# Altium schematic sheet Power_Path.SchDoc
size 297 x 209 mm; SheetNumber: 4; SheetTotal: 4
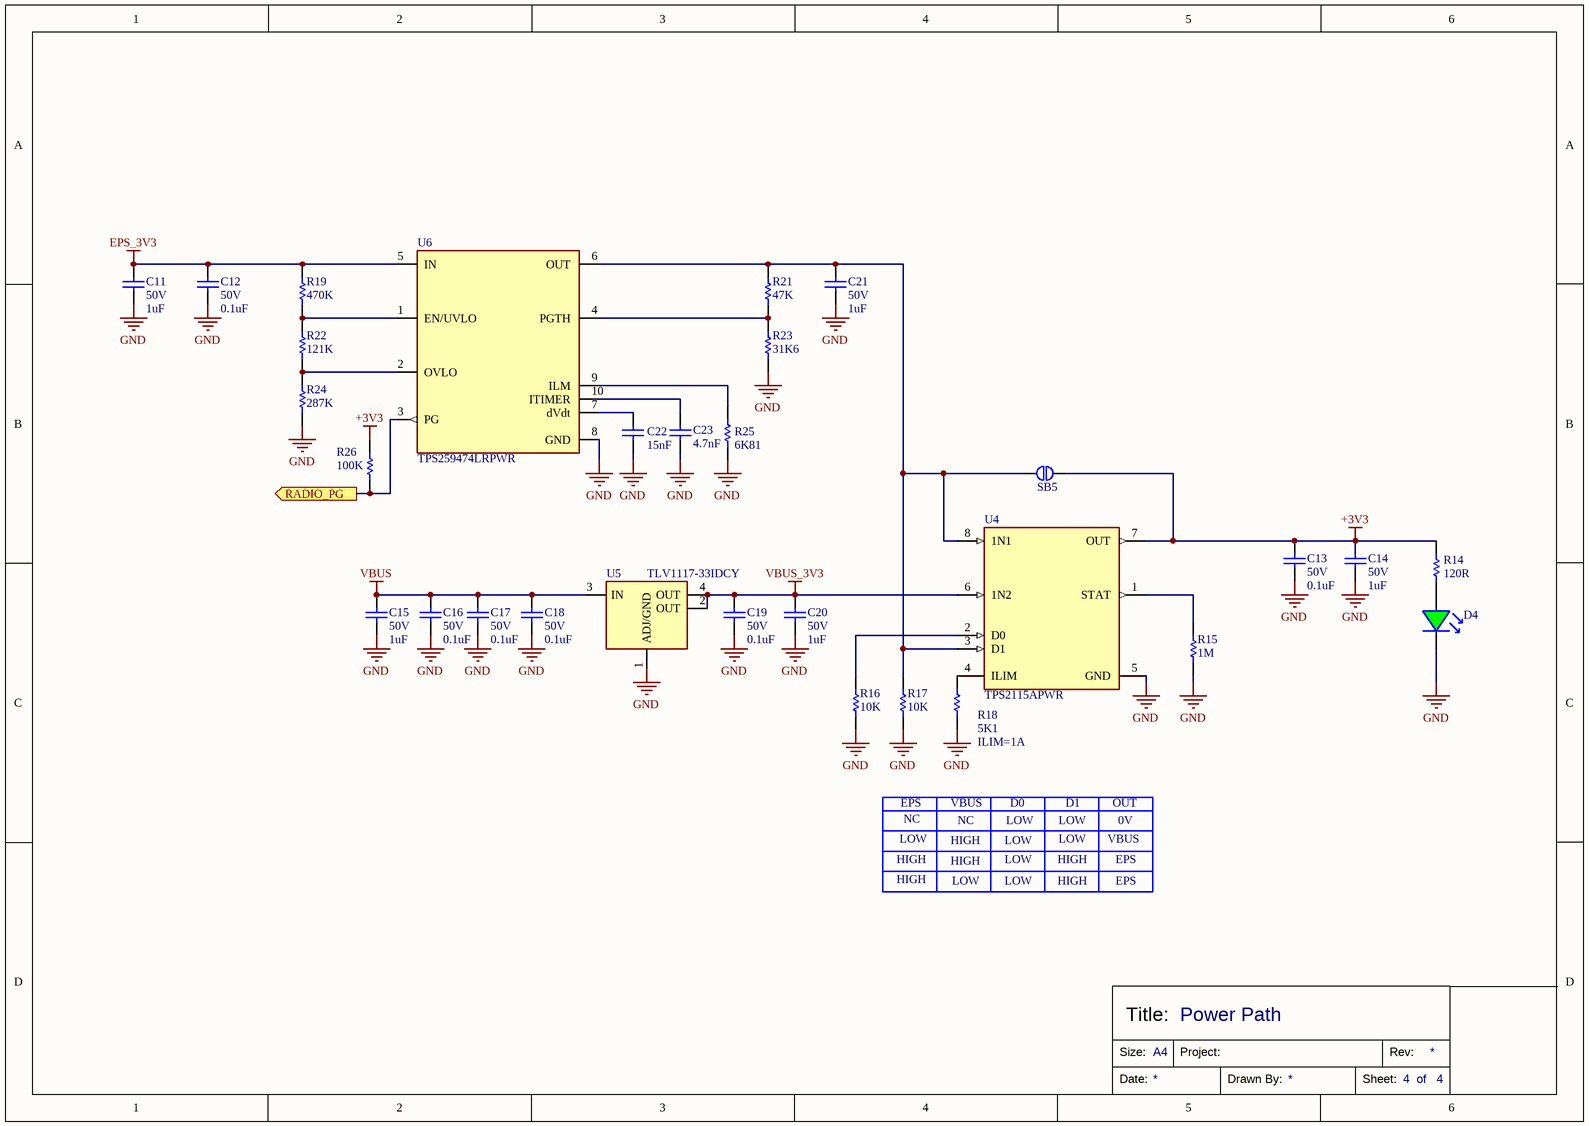
[diagram p0: Power_Path.SchDoc]

## Parts
C11  Voltage Rating: 50V  Capacitance: 1uF  [CAPC0805X060]  (hidden comment: CL21B105KBFNNNE_1)
C12  Voltage Rating: 50V  Capacitance: 0.1uF  [CAPC0402X020]  (hidden comment: CL05B104KB5NNNC)
C13  Voltage Rating: 50V  Capacitance: 0.1uF  [CAPC0402X020]  (hidden comment: CL05B104KB5NNNC)
C14  Voltage Rating: 50V  Capacitance: 1uF  [CAPC0805X060]  (hidden comment: CL21B105KBFNNNE_1)
C15  Voltage Rating: 50V  Capacitance: 1uF  [CAPC0805X060]  (hidden comment: CL21B105KBFNNNE_1)
C16  Voltage Rating: 50V  Capacitance: 0.1uF  [CAPC0402X020]  (hidden comment: CL05B104KB5NNNC)
C17  Voltage Rating: 50V  Capacitance: 0.1uF  [CAPC0402X020]  (hidden comment: CL05B104KB5NNNC)
C18  Voltage Rating: 50V  Capacitance: 0.1uF  [CAPC0402X020]  (hidden comment: CL05B104KB5NNNC)
C19  Voltage Rating: 50V  Capacitance: 0.1uF  [CAPC0402X020]  (hidden comment: CL05B104KB5NNNC)
C20  Voltage Rating: 50V  Capacitance: 1uF  [CAPC0805X060]  (hidden comment: CL21B105KBFNNNE_1)
C21  Voltage Rating: 50V  Capacitance: 1uF  [CAPC0805X060]  (hidden comment: CL21B105KBFNNNE_1)
C22  Capacitance: 15nF  [CAPC0603X040]  (hidden comment: C0603C153F3GACTU)
C23  Capacitance: 4.7nF  [CAPC0805X060]  (hidden comment: CL21B105KAFNNNE)
D4  LTST-C171KGKT  [LEDG_0805]  (value not drawn)
R14  Resistance: 120R  [RESC0805]  (hidden comment: RMCF0805FT120R)
R15  Resistance: 1M  [RESC0603]  (hidden comment: RMCF0603FT1M00)
R16  Resistance: 10K  [RESC0805]  (hidden comment: RMCF0805FT10K0)
R17  Resistance: 10K  [RESC0805]  (hidden comment: RMCF0805FT10K0)
R18  Resistance: 5K1  [RESC0603]  (hidden comment: RMCF0603FT5K10)
R19  Resistance: 470K  [RESC0603]  (hidden comment: RMCF0603FT470K)
R21  Resistance: 47K  [RESC0603]  (hidden comment: RMCF0603FT47K0)
R22  Resistance: 121K  [RESC0603]  (hidden comment: RMCF0603FT121K)
R23  Resistance: 31K6  [RESC0603]  (hidden comment: RMCF0603FT31K6)
R24  Resistance: 287K  [RESC0603]  (hidden comment: RMCF0603FT287K)
R25  Resistance: 6K81  [RESC0603]  (hidden comment: RMCF0603FT6K81)
R26  Resistance: 100K  [RESC0805]  (hidden comment: RMCF0805FG100K)
SB5  Solder Bridge Jumper  [Solder Bridge]  (value not drawn)  (no BOM)
U4  TPS2115APWR  [8-TSSOP]
U5  TLV1117-33IDCY  [TLV1117-33IDCY]
U6  TPS259474LRPWR  [VFQFN-10]

## Ports
RADIO_PG (out)

## Nets
+3V3: C13.2 C14.2 R14.2 R26.2 SB5.2 U4.7(OUT)
EPS_3V3: C11.2 C12.2 R19.2 U6.5(IN)
GND: C11.1 C12.1 C13.1 C14.1 C15.1 C16.1 C17.1 C18.1 C19.1 C20.1 C21.1 C22.1 C23.1 D4.K R15.1 R16.1 R17.1 R18.1 R23.1 R24.1 R25.1 U4.5(GND) U5.1(ADJ/GND) U6.8(GND)
VBUS: C15.2 C16.2 C17.2 C18.2 U5.3(IN)
VBUS_3V3: C19.2 C20.2 U4.6(1N2) U5.2(OUT) U5.4(OUT)
RADIO_PG: R26.1 U6.3(PG) ; port RADIO_PG
NetC21_2: C21.2 R17.2 R21.2 SB5.1 U4.3(D1) U4.8(1N1) U6.6(OUT)
NetC22_2: C22.2 U6.7(dVdt)
NetC23_2: C23.2 U6.10(ITIMER)
NetD4_A: D4.A R14.1
NetR15_2: R15.2 U4.1(STAT)
NetR16_2: R16.2 U4.2(D0)
NetR18_2: R18.2 U4.4(ILIM)
NetR19_1: R19.1 R22.2 U6.1(EN/UVLO)
NetR21_1: R21.1 R23.2 U6.4(PGTH)
NetR22_1: R22.1 R24.2 U6.2(OVLO)
NetR25_2: R25.2 U6.9(ILM)

## Notes on the sheet
- (near R18) ILIM=1A
- EPS
- VBUS
- D0
- D1
- OUT
- HIGH
- LOW
- NC
- 0V
- Power Path
- Size:
- Title:
- A4
- Project:
- Rev:
- Date:
- Drawn By:
- Sheet:
- of

## Library data of the parts
C11 C14 C15 C20 C21 = CL21B105KBFNNNE_1: 1uF 50V X7R ±10% 0805 Multilayer Ceramic Capacitors MLCC - SMD/SMT ROHS; Part Number: CL21B105KBFNNNE; Distributor Part Number: 1276-1029-1-ND; Tolerance: 10%; Case Code: 0805; Distributor: Digikey
C12 C13 C16-C19 = CL05B104KB5NNNC: 0.1 µF ±10% 50V Ceramic Capacitor X7R 0402 (1005 Metric); Part Number: CL05B104KB5NNNC; Tolerance: 10%; Distributor Part Number: 1276-CL05B104KB5NNNCCT-ND; Case Code: 0402; Distributor: Digikey
C22 = C0603C153F3GACTU: 0.015 µF ±1% 25V Ceramic Capacitor C0G, NP0 0603 (1608 Metric); Part Number: C0603C153F3GACTU; Tolerance: 1%; Distributor Part number: 399-C0603C153F3GACTUCT-ND; Case Code: 0603; Distributor: Digikey; Dielectric: C0G; Voltage Rating: 25V
C23 = CL21B472KBANNNC: 4.7nF ±10% 50V Ceramic Capacitor X7R 0805 (2012 Metric); Voltage Rating: 25V; Part Number: CL21B472KBANNNC; Distributor Part Number: 1276-1155-1-ND; Tolerance: 10%; Case Code: 0805; Distributor: Digikey
D4 = KT-0805G: LED Green 0805 00mW 120° 2.6V~3.1V 430mcd 513nm~528nm 525nm 5mA; Distributor Part Number: 160-1426-1-ND; Colour: Green; Operating Temperature: -40℃~+85℃; Distributor: Digikey; Part Number: LTST-C171KGKT
R14 = RMCF0805FT120R: 120 Ohms ±1% 0.125W, 1/8W Chip Resistor 0805 (2012 Metric) Automotive AEC-Q200 Thick Film; Part Number: RMCF0805FT120R; Tolerance: 1%; Distributor Part Number: 738-RMCF0805FT120RCT-ND; Distributor: Digikey; Case Code: 0805
R15 = RMCF0603FT1M00: 1 MOhms ±1% 0.1W, 1/10W Chip Resistor 0603 (1608 Metric) Automotive AEC-Q200 Thick Film; Part Number: RMCF0603FT1M00; Tolerance: 1%; Distributor: Digikey; Distributor Part Number: RMCF0603FT1M00CT-ND; Case Code: 0603
R16 R17 = RMCF0805FT10K0: 10 kOhms ±1% 0.125W, 1/8W Chip Resistor 0805 (2012 Metric) Automotive AEC-Q200 Thick Film; Part Number: RMCF0805FT10K0; Tolerance: 1%; Distributor Part Number: RMCF0805FT10K0CT-ND; Distributor: Digikey; Case Code: 0805
R18 = RMCF0603FT5K10: 5.1 kOhms ±1% 0.1W, 1/10W Chip Resistor 0603 (1608 Metric) Automotive AEC-Q200 Thick Film; Part Number: RMCF0603FT5K10; Tolerance: 1%; Distributor Part Number: RMCF0603FT5K10CT-ND; Distributor: Digikey; Case Code: 0603
R19 = RMCF0603FT470K: 470 kOhms ±1% 0.1W, 1/10W Chip Resistor 0603 (1608 Metric) Automotive AEC-Q200 Thick Film; Part Number: RMCF0603FT470K; Tolerance: 1%; Distributor: Digikey; Distributor Part Number: RMCF0603FT470KCT-ND; Case Code: 0603
R21 = RMCF0603FT47K0: 47 kOhms ±1% 0.1W, 1/10W Chip Resistor 0603 (1608 Metric) Automotive AEC-Q200 Thick Film; Part Number: RMCF0603FT47K0; Tolerance: 1%; Distributor: Digikey; Distributor Part Number: RMCF0603FT47K0CT-ND; Case Code: 0603
R22 = RMCF0603FT121K: 121 kOhms ±1% 0.1W, 1/10W Chip Resistor 0603 (1608 Metric) Automotive AEC-Q200 Thick Film; Part Number: RMCF0603FT121K; Tolerance: 1%; Distributor: Digikey; Distributor Part Number: RMCF0603FT121KCT-ND; Case Code: 0603
R23 = RMCF0603FT31K6: 31.6 kOhms ±1% 0.1W, 1/10W Chip Resistor 0603 (1608 Metric) Automotive AEC-Q200 Thick Film; Part Number: RMCF0603FT31K6; Tolerance: 1%; Distributor: Digikey; Distributor Part Number: RMCF0603FT31K6CT-ND; Case Code: 0603
R24 = RMCF0603FT287K: 287 kOhms ±1% 0.1W, 1/10W Chip Resistor 0603 (1608 Metric) Automotive AEC-Q200 Thick Film; Part Number: RMCF0603FT287K; Tolerance: 1%; Distributor: Digikey; Distributor Part Number: RMCF0603FT287KCT-ND; Case Code: 0603
R25 = RMCF0603FT6K81: 6.81 kOhms ±1% 0.1W, 1/10W Chip Resistor 0603 (1608 Metric) Automotive AEC-Q200 Thick Film; Part Number: RMCF0603FT6K81; Tolerance: 1%; Distributor: Digikey; Distributor Part Number: RMCF0603FT6K81CT-ND; Case Code: 0603
R26 = RMCF0805FG100K: 100 kOhms ±1% 0.125W, 1/8W Chip Resistor 0805 (2012 Metric) Automotive AEC-Q200 Thick Film; Part Number: RMCF0805FG100K; Tolerance: 1%; Distributor Part Number: RMCF0805FG100KCT-ND; Distributor: Digikey; Case Code: 0805
U4 = TPS2115APWR: 2.8-5.5-V, 84-m?, 1.25-A, power mux with manual, automatic switchover and status output 8-TSSOP -40 to 85; Min Input Voltage: 2.8V; Max Input Voltage: 5.5V; Imax: 1.25; Distributor part Number: 296-16940-1-ND; Operating Temperature Range: -40C to 85C; ComponentLink1Description: Datasheet; ComponentLink1URL: https://www.ti.com/lit/ds/symlink/tps2115a-q1.pdf?ts=1728842763076&ref_url=https%253A%252F%252Fwww.google.com%252F; Distributor: Digikey; Manufacturer Part Number: TPS2115APWR
U5 = TLV1117-33IDCY: 3.3V 800-mA, 15-V, linear voltage regulator 4-SOT-223 -40 to 125; Output Current: 800mA; Input Voltage - Min: 4.7V; Input Voltage - Max: 15V; Dropout Voltage: 1.2V; Part Number: TLV1117-33IDCY; Output Voltage: 3.3V; Operating Temperature: -40C~125C; Distributor: Digikey; Distributor Part Number: 296-26777-5-ND
U6 = TPS259474LRPWR: eFuse 5.5A, 2.7V~23V, 28mOhm, Reverse Current Blocking with Input Reverse Polarity Protection; Part Number: TPS259474LRPWR; Distributor: Digikey; Distributor Part Number: 296-TPS259474LRPWRCT-ND; Operating Temperature: -40°C ~ 125°C; Output Current: 5.5A; Voltage Input: 2.7V~23V